# Altium project Soldering station V2.1.PrjPcb
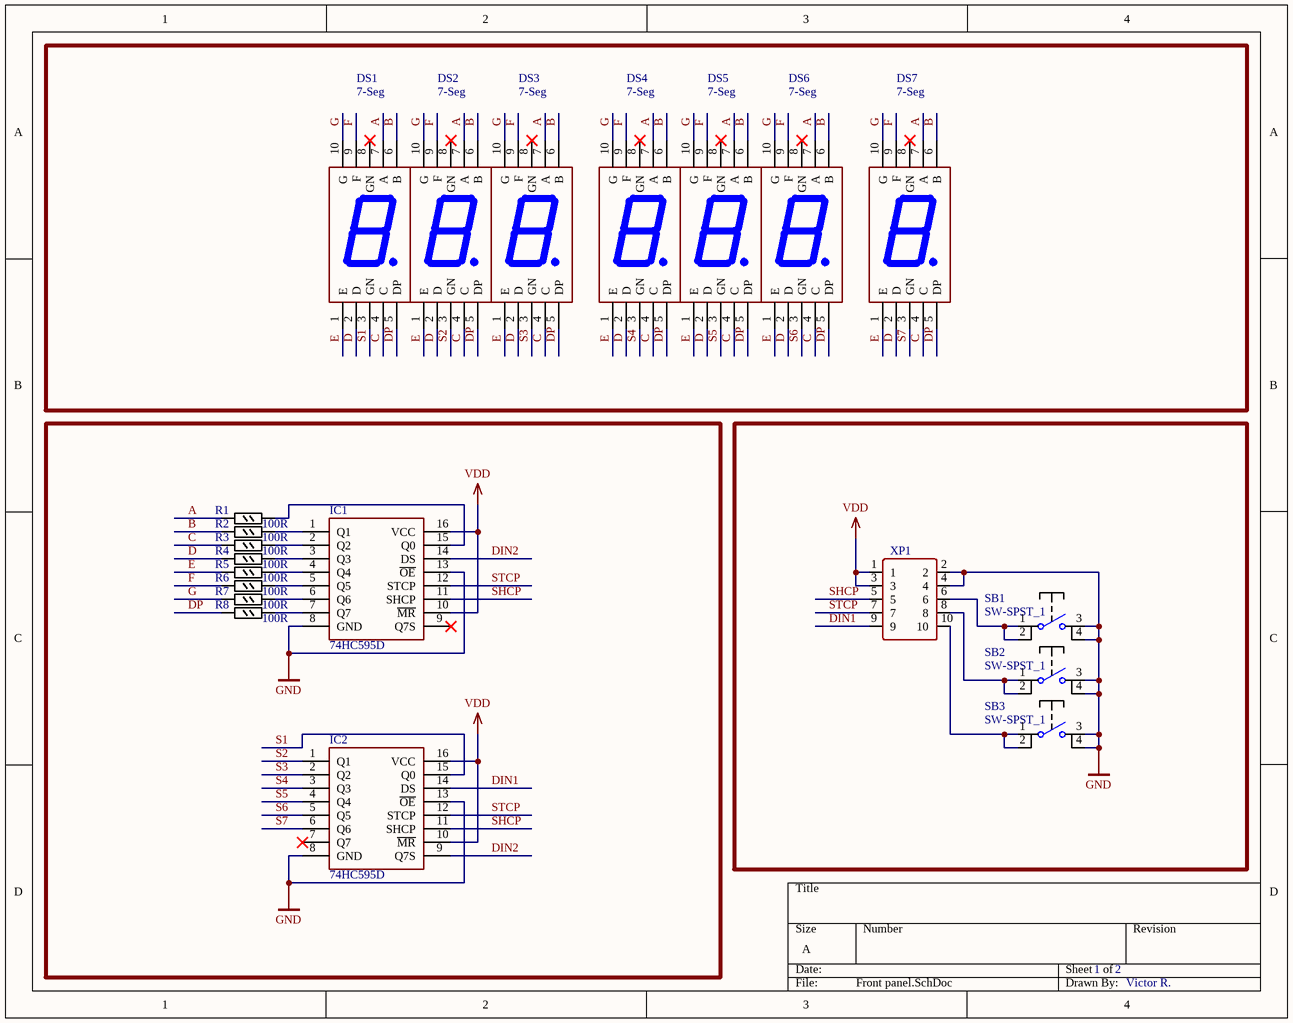
[diagram p0: Front panel.SchDoc]
2 sheets, 23 parts. Net scope: global (net labels, ports and power ports of the same name join across sheets).
Board files: Front panel.PcbDoc, Main board.PcbDoc
Sheets:
  Front panel.SchDoc
  Main board.SchDoc

## Sheet Front panel.SchDoc
size A; SheetNumber: 1; SheetTotal: 2

### Parts
DS1  7-Seg  [DIPS1524W51P254L1260H800Q10N]
DS2  7-Seg  [DIPS1524W51P254L1260H800Q10N]
DS3  7-Seg  [DIPS1524W51P254L1260H800Q10N]
DS4  7-Seg  [DIPS1524W51P254L1260H800Q10N]
DS5  7-Seg  [DIPS1524W51P254L1260H800Q10N]
DS6  7-Seg  [DIPS1524W51P254L1260H800Q10N]
DS7  7-Seg  [DIPS1524W51P254L1260H800Q10N]
IC1  74HC595D  [SOIC127P600X175-16N]
IC2  74HC595D  [SOIC127P600X175-16N]
R1  100R  [RESC2012(0805)N]
R2  100R  [RESC2012(0805)N]
R3  100R  [RESC2012(0805)N]
R4  100R  [RESC2012(0805)N]
R5  100R  [RESC2012(0805)N]
R6  100R  [RESC2012(0805)N]
R7  100R  [RESC2012(0805)N]
R8  100R  [RESC2012(0805)N]
SB1  SW-SPST_1  [B3FS_SWITCH]
SB2  SW-SPST_1  [B3FS_SWITCH]
SB3  SW-SPST_1  [B3FS_SWITCH]
XP1  BH-10  [BH-10]  (value not drawn)

### Nets
GND: IC1.8(GND) IC1.13(~{OE}) IC2.8(GND) IC2.13(~{OE}) SB1.3(COMMON) SB1.4(COMMON) SB2.3(COMMON) SB2.4(COMMON) SB3.3(COMMON) SB3.4(COMMON) XP1.2 XP1.4
VDD: IC1.10(~{MR}) IC1.16(VCC) IC2.10(~{MR}) IC2.16(VCC) XP1.1 XP1.3
A: DS1.7(A) DS2.7(A) DS3.7(A) DS4.7(A) DS5.7(A) DS6.7(A) DS7.7(A) R1.1
B: DS1.6(B) DS2.6(B) DS3.6(B) DS4.6(B) DS5.6(B) DS6.6(B) DS7.6(B) R2.1
C: DS1.4(C) DS2.4(C) DS3.4(C) DS4.4(C) DS5.4(C) DS6.4(C) DS7.4(C) R3.1
D: DS1.2(D) DS2.2(D) DS3.2(D) DS4.2(D) DS5.2(D) DS6.2(D) DS7.2(D) R4.1
DIN1: IC2.14(DS) XP1.9
DIN2: IC1.14(DS) IC2.9(Q7S)
DP: DS1.5(DP) DS2.5(DP) DS3.5(DP) DS4.5(DP) DS5.5(DP) DS6.5(DP) DS7.5(DP) R8.1
E: DS1.1(E) DS2.1(E) DS3.1(E) DS4.1(E) DS5.1(E) DS6.1(E) DS7.1(E) R5.1
F: DS1.9(F) DS2.9(F) DS3.9(F) DS4.9(F) DS5.9(F) DS6.9(F) DS7.9(F) R6.1
G: DS1.10(G) DS2.10(G) DS3.10(G) DS4.10(G) DS5.10(G) DS6.10(G) DS7.10(G) R7.1
S1: DS1.3(GN) IC2.15(Q0)
S2: DS2.3(GN) IC2.1(Q1)
S3: DS3.3(GN) IC2.2(Q2)
S4: DS4.3(GN) IC2.3(Q3)
S5: DS5.3(GN) IC2.4(Q4)
S6: DS6.3(GN) IC2.5(Q5)
S7: DS7.3(GN) IC2.6(Q6)
SHCP: IC1.11(SHCP) IC2.11(SHCP) XP1.5
STCP: IC1.12(STCP) IC2.12(STCP) XP1.7
NetIC1_1: IC1.1(Q1) R2.2
NetIC1_2: IC1.2(Q2) R3.2
NetIC1_3: IC1.3(Q3) R4.2
NetIC1_4: IC1.4(Q4) R5.2
NetIC1_5: IC1.5(Q5) R6.2
NetIC1_6: IC1.6(Q6) R7.2
NetIC1_7: IC1.7(Q7) R8.2
NetIC1_15: IC1.15(Q0) R1.2
NetSB1_1: SB1.1(COMMON) SB1.2(NO) XP1.6
NetSB2_1: SB2.1(COMMON) SB2.2(NO) XP1.8
NetSB3_1: SB3.1(COMMON) SB3.2(NO) XP1.10

Not connected (* = marked no-connect by the designer): DS1 8(GN)*; DS2 8(GN)*; DS3 8(GN)*; DS4 8(GN)*; DS5 8(GN)*; DS6 8(GN)*; DS7 8(GN)*; IC1 9(Q7S)*; IC2 7(Q7)*

### Notes on the sheet
- 1     2
- Victor R.

### Library data of the parts
DS1-DS7 = 7-Seg: Display; Manufacturer_Name: Sunrom; Manufacturer_Part_Number: 4258; Datasheet Link: https://www.sunrom.com/get/328636; Height: 8mm
IC1 IC2 = 74HC595D: Integrated Circuit; Manufacturer_Name: NXP; Datasheet Link: https://assets.nexperia.com/documents/data-sheet/74HC_HCT595.pdf; Height: 1.75mm; Manufacturer_Part_Number: 74HC595D; Mouser Part Number: N/A; Mouser Price/Stock: https://www.mouser.co.uk/ProductDetail/NXP-Semiconductors/74HC595D?qs=KBAwV6Cvgt0f%252BALigJeNTw%3D%3D
R1-R8 = RESC2012(0805): Part Number: RESC2012(0805); Package: 0805
XP1 = 302-S101: Connector Header Through Hole 10 position 0.100" (2.54mm); Part Number: 302-S101; HelpURL: https://www.digikey.com/product-detail/en/on-shore-technology-inc/302-S101/ED1543-ND/2178422; Digi-Key Part Number: ED1543-ND; Price$: 0.13125; Manufacturer Part Number: 302-S101; Package: Header 10POS 2.54mm
SB1-SB3 = SW-SPST_1: Part Number: SW-SPST_1

## Sheet Main board.SchDoc
size B; SheetNumber: 2; SheetTotal: 2
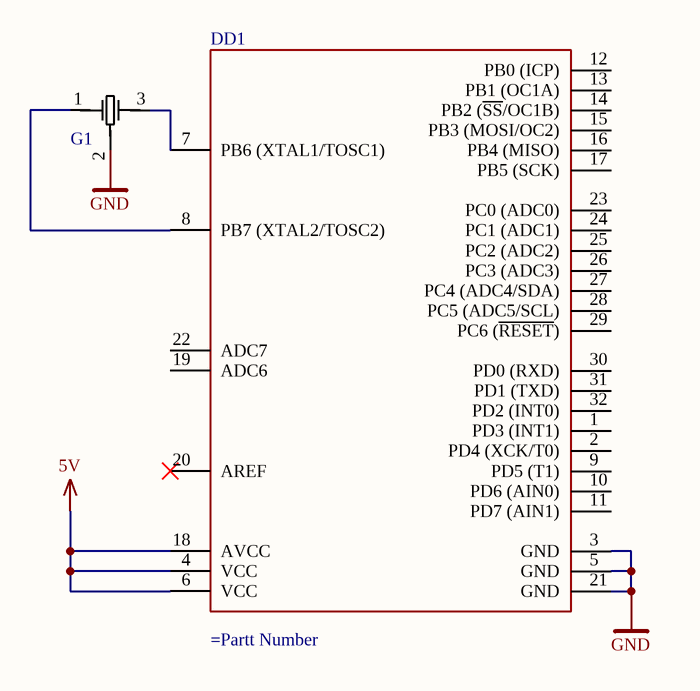
[diagram p1: Main board.SchDoc]

### Parts
DD1  (no value)  [TQFP32_N]
G1  8MHz 33pF  [CSTNE_G]  (value not drawn)

### Nets
5V: DD1.4(VCC) DD1.6(VCC) DD1.18(AVCC)
GND: DD1.3(GND) DD1.5(GND) DD1.21(GND) G1.2
NetDD1_7: DD1.7(PB6_(XTAL1/TOSC1)) G1.3
NetDD1_8: DD1.8(PB7_(XTAL2/TOSC2)) G1.1

Not connected (* = marked no-connect by the designer): DD1 1(PD3_(INT1)) 2(PD4_(XCK/T0)) 9(PD5_(T1)) 10(PD6_(AIN0)) 11(PD7_(AIN1)) 12(PB0_(ICP)) 13(PB1_(OC1A)) 14(PB2_(~{SS}/OC1B)) 15(PB3_(MOSI/OC2)) 16(PB4_(MISO)) 17(PB5_(SCK)) 19(ADC6) 20(AREF)* 22(ADC7) 23(PC0_(ADC0)) 24(PC1_(ADC1)) 25(PC2_(ADC2)) 26(PC3_(ADC3)) 27(PC4_(ADC4/SDA)) 28(PC5_(ADC5/SCL)) 29(PC6_(~{RESET})) 30(PD0_(RXD)) 31(PD1_(TXD)) 32(PD2_(INT0))

### Library data of the parts
DD1 = ATMEGA328: IC MCU 8BIT 32KB FLASH 32TQFP; Manufacturer Part Number: ATMEGA328PB-AU; Part Number: ATMEGA328; HelpURL: https://www.digikey.com/product-detail/en/microchip-technology/ATMEGA328PB-AU/ATMEGA328PB-AU-ND/5638812; Digi-Key Part Number: ATMEGA328PB-AU-ND
G1 = CSTNE8M00G550000R0: Resonators 8.0000MHz 33pF SMD CHP Resntr; Part Number: CSTNE8M00G550000R0; HelpURL: https://www.mouser.com/ProductDetail/Murata-Electronics/CSTNE8M00G550000R0?qs=sGAEpiMZZMsBj6bBr9Q9aZiWbAMN9VKZL2sPd%252BqabYTr9Kzmh3hi1Q%3D%3D; Price$: 0.148; Digi-Key Part Number: 490-17958-1-ND; Manufacturer Part Number: CSTNE8M00G550000R0; Package: SMD-3pin; Mouser Part Number: 81-CSTNE8M00G550000R

## Nets that join several sheets
GND: Front panel (12 pins), Main board (DD1.3 DD1.5 DD1.21 G1.2)